# Altium schematic sheet contactors_6_to_8.SchDoc
size A3; DocumentNumber: 3; SheetNumber: 3; SheetTotal: 14; SheetDescription: Contactors 6-8
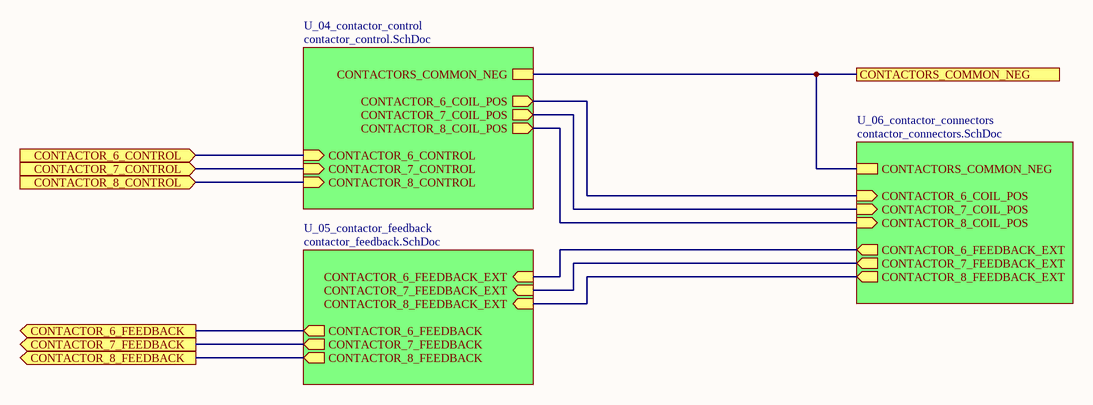
[diagram p0: contactors_6_to_8.SchDoc]

## Sub-sheets
U_04_contactor_control = contactor_control.SchDoc: CONTACTORS_COMMON_NEG, CONTACTOR_6_COIL_POS (out), CONTACTOR_7_COIL_POS (out), CONTACTOR_8_COIL_POS (out), CONTACTOR_6_CONTROL (in), CONTACTOR_7_CONTROL (in), CONTACTOR_8_CONTROL (in)
U_05_contactor_feedback = contactor_feedback.SchDoc: CONTACTOR_6_FEEDBACK_EXT (in), CONTACTOR_7_FEEDBACK_EXT (in), CONTACTOR_8_FEEDBACK_EXT (in), CONTACTOR_6_FEEDBACK (out), CONTACTOR_7_FEEDBACK (out), CONTACTOR_8_FEEDBACK (out)
U_06_contactor_connectors = contactor_connectors.SchDoc: CONTACTORS_COMMON_NEG, CONTACTOR_6_COIL_POS (in), CONTACTOR_6_FEEDBACK_EXT (out), CONTACTOR_7_COIL_POS (in), CONTACTOR_7_FEEDBACK_EXT (out), CONTACTOR_8_COIL_POS (in), CONTACTOR_8_FEEDBACK_EXT (out)

## Ports
CONTACTOR_6_CONTROL (in), CONTACTOR_6_FEEDBACK (out), CONTACTOR_7_CONTROL (in), CONTACTOR_7_FEEDBACK (out), CONTACTOR_8_CONTROL (in), CONTACTOR_8_FEEDBACK (out), CONTACTORS_COMMON_NEG

## Nets
CONTACTOR_6_CONTROL: port CONTACTOR_6_CONTROL, sheet U_04_contactor_control/CONTACTOR_6_CONTROL
CONTACTOR_6_FEEDBACK: port CONTACTOR_6_FEEDBACK, sheet U_05_contactor_feedback/CONTACTOR_6_FEEDBACK
CONTACTOR_7_CONTROL: port CONTACTOR_7_CONTROL, sheet U_04_contactor_control/CONTACTOR_7_CONTROL
CONTACTOR_7_FEEDBACK: port CONTACTOR_7_FEEDBACK, sheet U_05_contactor_feedback/CONTACTOR_7_FEEDBACK
CONTACTOR_8_CONTROL: port CONTACTOR_8_CONTROL, sheet U_04_contactor_control/CONTACTOR_8_CONTROL
CONTACTOR_8_FEEDBACK: port CONTACTOR_8_FEEDBACK, sheet U_05_contactor_feedback/CONTACTOR_8_FEEDBACK
CONTACTORS_COMMON_NEG: port CONTACTORS_COMMON_NEG, sheet U_04_contactor_control/CONTACTORS_COMMON_NEG, sheet U_06_contactor_connectors/CONTACTORS_COMMON_NEG
(unnamed): sheet U_04_contactor_control/CONTACTOR_6_COIL_POS, sheet U_06_contactor_connectors/CONTACTOR_6_COIL_POS
(unnamed): sheet U_04_contactor_control/CONTACTOR_7_COIL_POS, sheet U_06_contactor_connectors/CONTACTOR_7_COIL_POS
(unnamed): sheet U_04_contactor_control/CONTACTOR_8_COIL_POS, sheet U_06_contactor_connectors/CONTACTOR_8_COIL_POS
(unnamed): sheet U_05_contactor_feedback/CONTACTOR_6_FEEDBACK_EXT, sheet U_06_contactor_connectors/CONTACTOR_6_FEEDBACK_EXT
(unnamed): sheet U_05_contactor_feedback/CONTACTOR_7_FEEDBACK_EXT, sheet U_06_contactor_connectors/CONTACTOR_7_FEEDBACK_EXT
(unnamed): sheet U_05_contactor_feedback/CONTACTOR_8_FEEDBACK_EXT, sheet U_06_contactor_connectors/CONTACTOR_8_FEEDBACK_EXT

## Notes on the sheet
- Fraunhofer IISB
- Schottkystr. 10
- developed by:
- 91058 Erlangen
- Germany
- Author
- Project
- License
- Description
- File
- Version
- Release Date
- Sheet
- www.foxbms.org
- www.iisb.fraunhofer.de
- foxBMS Team
- /